# Altium schematic sheet slave.SchDoc: Slave Circuit
size A4; SheetNumber: 3; SheetTotal: 3
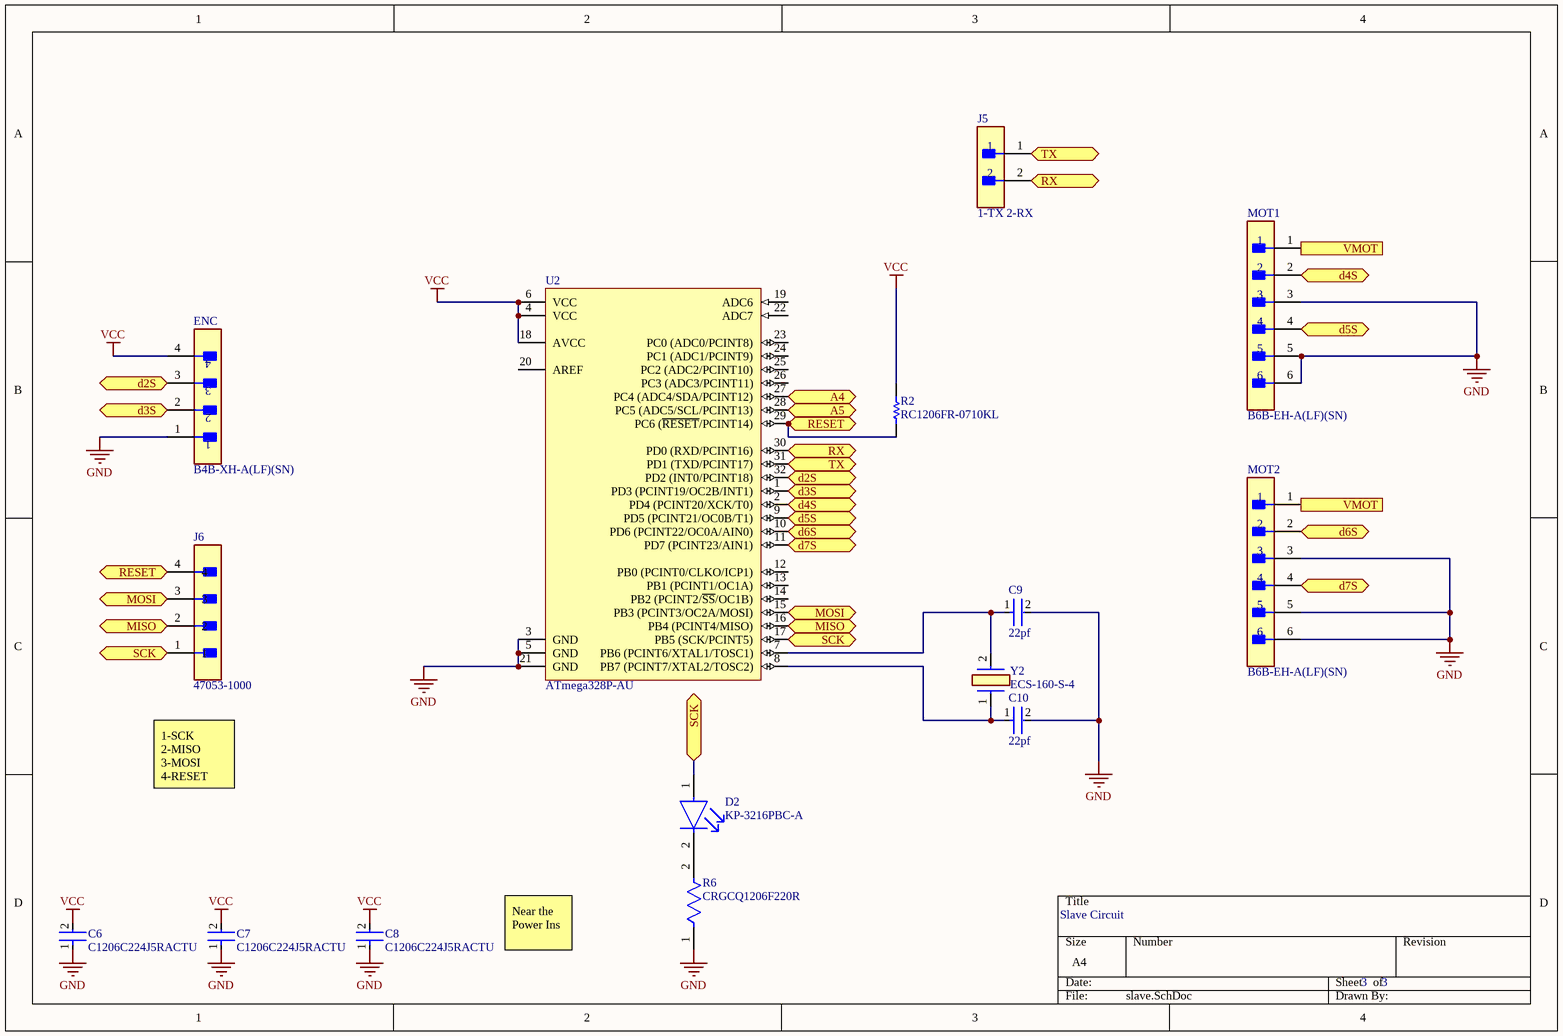
[diagram p0: slave.SchDoc]

## Parts
C6  C1206C224J5RACTU  [FP-C1206C-EB-MFG]
C7  C1206C224J5RACTU  [FP-C1206C-EB-MFG]
C8  C1206C224J5RACTU  [FP-C1206C-EB-MFG]
C9  22pf  [FP-C1206C-EB-MFG]
C10  22pf  [FP-C1206C-EB-MFG]
D2  KP-3216PBC-A  [FP-KP-3216PBC-A-MFG]
ENC  B4B-XH-A(LF)(SN)  [FP-B4B-XH-A_LF_SN-MFG]
J5  1-TX 2-RX  [FP-M22-2010205-MFG]
J6  47053-1000  [FP-470531000-MFG]
MOT1  B6B-EH-A(LF)(SN)  [FP-B6B-EH-A_LF_SN-MFG]
MOT2  B6B-EH-A(LF)(SN)  [FP-B6B-EH-A_LF_SN-MFG]
R2  RC1206FR-0710KL  [RESC3116X65X40ML10T20]
R6  CRGCQ1206F220R  [FP-CRGCQ1206-IPC_C]
U2  ATmega328P-AU  [32A_M]
Y2  ECS-160-S-4  [ECS160S4]

## Ports
A4 (bidir), A5 (bidir), d2S (bidir), d3S (bidir), d4S (bidir), d5S (bidir), d6S (bidir), d7S (bidir), MISO (bidir), MOSI (bidir), RESET (bidir), RX (bidir), SCK (bidir), TX (bidir), VMOT

## Nets
GND: C6.1 C7.1 C8.1 C9.2 C10.2 ENC.1 MOT1.3 MOT1.5 MOT1.6 MOT2.3 MOT2.5 MOT2.6 R6.1 U2.3(GND) U2.5(GND) U2.21(GND)
VCC: C6.2 C7.2 C8.2 ENC.4 R2.2 U2.4(VCC) U2.6(VCC) U2.18(AVCC)
A4: U2.27(PC4_(ADC4/SDA/PCINT12)) ; port A4
A5: U2.28(PC5_(ADC5/SCL/PCINT13)) ; port A5
d2S: ENC.3 U2.32(PD2_(INT0/PCINT18)) ; port d2S
d3S: ENC.2 U2.1(PD3_(PCINT19/OC2B/INT1)) ; port d3S
d4S: MOT1.2 U2.2(PD4_(PCINT20/XCK/T0)) ; port d4S
d5S: MOT1.4 U2.9(PD5_(PCINT21/OC0B/T1)) ; port d5S
d6S: MOT2.2 U2.10(PD6_(PCINT22/OC0A/AIN0)) ; port d6S
d7S: MOT2.4 U2.11(PD7_(PCINT23/AIN1)) ; port d7S
MISO: J6.2 U2.16(PB4_(PCINT4/MISO)) ; port MISO
MOSI: J6.3 U2.15(PB3_(PCINT3/OC2A/MOSI)) ; port MOSI
RESET: J6.4 R2.1 U2.29(PC6_(~{RESET}/PCINT14)) ; port RESET
RX: J5.2 U2.30(PD0_(RXD/PCINT16)) ; port RX
SCK: D2.1(A) J6.1 U2.17(PB5_(SCK/PCINT5)) ; port SCK
TX: J5.1 U2.31(PD1_(TXD/PCINT17)) ; port TX
VMOT: MOT1.1 MOT2.1 ; port VMOT
NetC9_1: C9.1 U2.7(PB6_(PCINT6/XTAL1/TOSC1)) Y2.2
NetC10_1: C10.1 U2.8(PB7_(PCINT7/XTAL2/TOSC2)) Y2.1
NetD2_2: D2.2(C) R6.2

Not connected (* = marked no-connect by the designer): U2 12(PB0_(PCINT0/CLKO/ICP1)) 13(PB1_(PCINT1/OC1A)) 14(PB2_(PCINT2/~{SS}/OC1B)) 19(ADC6) 20(AREF) 22(ADC7) 23(PC0_(ADC0/PCINT8)) 24(PC1_(ADC1/PCINT9)) 25(PC2_(ADC2/PCINT10)) 26(PC3_(ADC3/PCINT11))

## Notes on the sheet
- 1-SCK
  2-MISO
  3-MOSI
  4-RESET
- Near the Power Ins

## Library data of the parts
C6-C8 = CMP-03020-008405-1: CAP CER 0.22UF 50V X7R 1206; Manufacturer: KEMET; Material: Ceramic; Temperature Coefficient: 15%; Capacitance: 0.22 μF; Value: 0.22 μF; Tolerance: 0.05; Automotive Grade: Grade 0; Ipc Land Pattern Name: CAPC320160X78; Device Class L1: Passive Components; Digikey Description: CAP CER 0.22UF 50V X7R 1206; Device Class L2: Capacitors; Temperature: -55°C to +150°C; Mouser Description: Multilayer Ceramic Capacitors MLCC - SMD/SMT 50volts 0.22uF X7R 5%; Octopart: https://octopart.com/c1206c224j5ractu-kemet-91653; ComponentLink2URL: https://content.kemet.com/datasheets/KEM_C1007_X8R_ULTRA_150C_SMD.pdf; Package: C1206C-EB; Height: 0.88mm; Category: Cap; Automotive: Yes; Manufacturer Part Number: C1206C224J5RACTU; ComponentLink2Description: Datasheet; Temperature Range Low: -55°C; RoHS: TRUE; Temperature Characteristic: X7R; Lead Free: Yes; Voltage Rating: 50 V; Device Class L3: Ceramic Capacitors; Temperature Range High: +150°C
C9 C10 = CMP-1037-00978-2: 1206 22pF Ceramic Multilayer Capacitor; 50VDC; 125degC; C0G Dielec; +/-5% SMD; Manufacturer Part Number: C1206C220J5GACTU; Manufacturer: KEMET; Automotive Grade: Grade 0; Temperature Coefficient: 15%; Tolerance: 0.05; Voltage Rating: 50 V; Height: 0.88mm; Mouser Description: 1206 22pF Ceramic Multilayer Capacitor; 50VDC; 125degC; C0G Dielec; +/-5% SMD; Ipc Land Pattern Name: CAPC320160X78; Temperature Range High: +150°C; Automotive: Yes; Device Class L3: Ceramic Capacitors; ComponentLink2Description: Datasheet; Temperature: -55°C to +150°C; Lead Free: Yes; Category: Cap; Device Class L2: Capacitors; Device Class L1: Passive Components; Value: 22 pF; Capacitance: 22 pF; Digikey Description: 1206 22pF Ceramic Multilayer Capacitor; 50VDC; 125degC; C0G Dielec; +/-5% SMD; Octopart: https://octopart.com/c1206c220j5gactu-kemet-131912; Material: Ceramic; Temperature Characteristic: C0G; Package: C1206C-EB; RoHS: TRUE; ComponentLink2URL: https://content.kemet.com/datasheets/KEM_C1007_X8R_ULTRA_150C_SMD.pdf; Temperature Range Low: -55°C
D2 = CMP-44529-000052-1: LED, Low Power, Blue, SMD, 1.6mm x 2mm, 20 mA, 3.2 V, 470 nm; Forward Voltage: 3.2V; Wavelength: 470nm; Luminous Intensity: 60mcd; Lens Color: Clear; Forward Current: 20mA; Viewing Angle: 120°; Number of LEDs: 1; Lens Style: Rectangular; Color: Blue; Case/Package: 3216; Dominant Wavelength: 470nm; Series: 1206; RoHS Compliant: No; Packaging: Cut Tape; Number of Pins: 2; Mount: Surface Mount; REACH SVHC: No SVHC
ENC = CMP-17439-000250-1: CONN HEADER VERT 4POS 2.5MM; Number of Contacts: 4; Contact Resistance: 20mR; Voltage Rating: 250V; Max Current Rating: 3A; Gender: Male; Wire/Cable Gauge: 22AWG; Mated Stacking Heights: 9.8mm; Insulation Resistance: 1GR; Orientation: Straight; Contact Type: Male Pin; Contact Finish - Mating: TIN; Series: XH; Max Voltage Rating (AC): 250V; Lead Pitch: 2.5mm; Contact Shape: Square; Insulation Color: Natural; Termination: Solder; Lead Free: Lead Free; Voltage Rating (AC): 250V; Number of Rows: 1; Flammability Rating: UL94 V-0; Number of Positions: 4; Max Operating Temperature: 85°C; Package Quantity: 500; Mount: Through Hole; REACH SVHC: No SVHC; Connector Type: Header; Insulation Material: Nylon; Fastening Type: Detent; Min Operating Temperature: -25°C; Housing Color: White; Packaging: Bulk; Contact Plating: Tin; Contact Material: Brass; Max Voltage Rating (DC): 250V; Housing Material: Polyamide; Color: Natural; Material: Polyamide; Pitch: 2.5mm; Depth: 5.75mm; Current Rating: 3A; Length: 12.4mm
J5 = CMP-15831-000101-1: CONN HEADER VERT 2POS 2MM; Max Current Rating: 1A; Connector Type: Male Pin; Voltage Rating (AC): 250V; Voltage Rating: 650V; Gender: Male; Mated Stacking Heights: 8.6mm; Number of Positions: 2; Insulation Resistance: 10GR; Contact Resistance: 20mR; Package Quantity: 1000; Insulation Material: Nylon; Contact Plating: Gold; Flammability Rating: UL94 V-0; Reach SVHC Compliant: Yes; Mount: Through Hole; Radiation Hardening: No; Depth: 2mm; Case/Package: SIL; Contact Finish - Mating: GOLD; Contact Type: Male Pin; Contact Shape: Square; Contact Material: Bronze; Min Operating Temperature: -55°C; Housing Material: Nylon; Insulation Color: Black; Current Rating: 1A; Contact Mating Length: 0.138inch; Number of Rows: 1; Length: 4mm; Color: Black; Orientation: Straight; Housing Color: Black; Series: M22; Pitch: 2mm; Fastening Type: Pull; Packaging: Bulk; Termination: Solder; Number of Contacts: 2; Max Operating Temperature: 105°C
J6 = CMP-04776-000290-2: CONN HEADER VERT 4POS 2.54MM; NexarPartId: 854935; Manufacturer Lifecycle Status: ACTIVE; Voltage Rating (DC): 250V; Gender: Male; Plating: Copper; Number of Positions: 4; Glow Wire Compliant: Non-compliant; Current Rating: 500mA; Max Operating Temperature: 75°C; Number of Rows: 1; REACH SVHC: Unknown; Ambient Temperature Range High: 105°C; Pitch: 2.54mm; Height: 7.7mm; Min Operating Temperature: 0°C; Packaging: Bulk; Contact Material: Brass, Copper; Contact Plating: Tin; Lead Pitch: 2.54mm; Voltage Rating: 250V; Termination: Through Hole; Radiation Hardening: No; Orientation: Vertical; Mount: Through Hole; Number of Pins: 4; Country of Origin: HK; Halogen Free: Low Halogen; Lifecycle Status: Production; Number of Circuits: 4; Schedule B: 8536694040, 8536694040; Housing Color: Beige; Housing Material: Nylon; Depth: 5.84mm; RoHS: Compliant; Length: 10.2mm; Number of Contacts: 4
MOT1 MOT2 = CMP-17439-000293-1: CONN HEADER VERT 6POS 2.5MM; Voltage Rating: 250V; Number of Positions: 6; Current Rating: 3A; Mated Stacking Heights: 8.1mm; Gender: Male; Insulation Material: Nylon; Number of Contacts: 6; Contact Plating: Tin; Pitch: 2.5mm; Orientation: Straight; Insulation Color: Natural; Packaging: Bulk; Termination: Solder; Flammability Rating: UL94 V-0; Lead Free: Lead Free; Contact Mating Length: 0.13inch; Color: Natural; Contact Finish - Mating: TIN; Connector Type: Header; Contact Shape: Square; Contact Type: Male Pin; Series: EH; Contact Material: Brass; Fastening Type: Friction; Number of Rows: 1; Mount: Through Hole; Housing Color: White
R2 = CMP-1014-00623-2: Chip Resistor, 10 KOhm, +/- 1%, 0.25 W, -55 to 155 degC, 1206 (3216 Metric), RoHS, Tape and Reel; Manufacturer: Yageo; Voltage Rating: 200V; Resistance: 10KOhm; Temperature Coefficient: 100ppm/degreesC; Power Rating: 250mW; Packaging: TapeandReel; Termination: SMD/SMT; REACH SVHC: Unknown; Tolerance: 1%; Height: 0.55mm; Composition: ThickFilm; Max Operating Temperature: 155degC; Datasheet Version: Rev. 5, 10/2016; Lead Free: LeadFree; Case Code (Metric): 3216; Depth: 1.6mm; Package Quantity: 5000; RoHSCompliant: true; Military Standard: Not; Case/Package: 1206; Case Code (Imperial): 1206; Min Operating Temperature: -55degC; Datasheet URL: http://www.yageo.com/NewPortal/yageodocoutput?fileName=/pdf/R-Chip/PYu-RC_Group_51_RoHS_L_5.pdf; Length: 3.1mm; Manufacturer URL: http://www.yageo.com/; Package Reference: 1206.0; Width: 1.6mm; Package Description: 2-Pin Surface Mount Device, Body 3.1 x 1.6 mm
R6 = CMP-03211-008395-1: CRGCQ1206 220Ω 0.25W 1% ±100ppm/°C 200V; Manufacturer: TE Connectivity; Automotive Grade: Grade 529; Tolerance: 0.01; Power Rating: 0.25W; Resistance: 220Ω; Octopart: https://octopart.com/crgcq1206f220r-te+connectivity-91018264; Manufacturer Part Number: CRGCQ1206F220R; Device Class L1: Passive Components; Ipc Land Pattern Name: RESC310155X55; Height: 0.65mm; Automotive: Yes; Temperature: -55°C to +155°C; Lead Free: Yes; Device Class L3: Chip SMD Resistors; Voltage Rating: 200V; Temperature Range High: +155°C; Device Class L2: Resistors; Temperature Range Low: -55°C; Temperature Coefficient: ±100ppm/°C; ComponentLink2Description: Datasheet; RoHS: TRUE; Series: CRGCQ; ComponentLink2URL: https://www.te.com/commerce/DocumentDelivery/DDEController?Action=showdoc&DocId=Data+Sheet%7F1773204-3%7F1%7Fpdf%7FEnglish%7FENG_DS_1773204-3_1.pdf%7F4-2176347-538; Category: Res; Package: CRGCQ1206; Composition: Thick Film; Ambient Temperature Range High: +70°C; Value: 220Ω
U2 = CMP-0095-00269-2: 8-bit AVR Microcontroller, 32KB Flash, 1KB EEPROM, 2KB SRAM, 32-pin TQFP, Industrial Grade (-40°C to 85°C); PackageDescription: 32-Lead, 7x7x1.0 mm Body, 0.8mm Lead Pitch, Thin Profile Plastic Quad Flat Package (TQFP); DatasheetVersion: revD, May-2011; RevisionNote: DatasheetVersion & PackageVersion updated. URLs added.; ComponentLink1URL: http://www.atmel.com/; ComponentLink2Description: ATmega48A/48PA/88A/88PA/168A/168PA/328/328P Datasheet; Code_JEDEC: MS-026-ABA; ComponentLink1Description: Manufacturer URL; PackageReference: 32A; ComponentLink3Description: ATmega48A/48PA/88A/88PA/168A/168PA/328/328P Summary; ComponentLink2URL: http://www.atmel.com/dyn/resources/prod_documents/doc8271.pdf; PackageVersion: revC, Oct-2010; ComponentLink3URL: http://www.atmel.com/dyn/resources/prod_documents/8271S.pdf
Y2 = ECS-160-S-4: Crystal or Oscillator; Manufacturer_Name: ECS; Datasheet Link: http://www.ecsxtal.com/store/pdf/hc_49us.pdf; Height: 3.5mm; Manufacturer_Part_Number: ECS-160-S-4; Mouser Part Number: 520-HCU1600-S; Mouser Price/Stock: https://www.mouser.co.uk/ProductDetail/ECS/ECS-160-S-4?qs=CNVyLAqdhH0J%2FZuif68kGw%3D%3D